# EAGLE design SD SPI SH Adaptor (EAGLE 9.6.2)
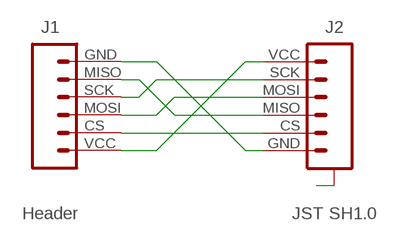
[diagram p0: schematic, sheet 1]

## Parts
J1  Header  HEADER-1X6-SD-SPI  [CONN_06-SD-SPI]
J2  JST SH1.0  JST-SH1.0-6-SMD-HORIZONTAL-SPI  [JST-SH1.0-6-HORIZONTAL-SPI]

## Nets
A: J2.A@1(A) J2.A@6(A)
N$1: J1.GND J2.GND
N$2: J1.VCC J2.VCC
N$3: J1.MISO J2.MISO
N$4: J1.MOSI J2.MOSI
N$5: J1.SCK J2.SCK
N$6: J1.CS J2.CS

## Library data of the parts
J1 = digitalconcepts:HEADER-1X6-SD-SPI: Single Row 6-Pin Header for SD Card Reader SPI Interface
J2 = digitalconcepts:JST-SH1.0-6-SMD-HORIZONTAL-SPI: JST SH1.0 6P SMD SPI horizontal connector

## Board
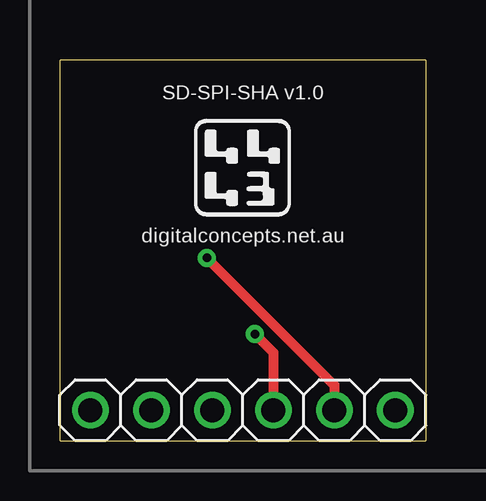
[diagram p1: board, top side]
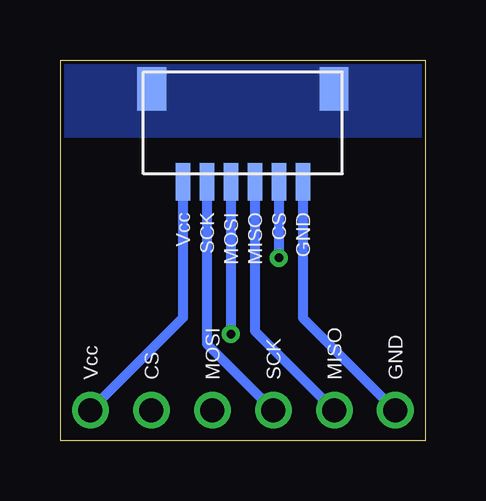
[diagram p2: board, bottom side, seen from below]

Size 15.24 x 15.88 mm. Coordinates in mm from the lower left corner, seen from the top.
Outline: 0,0 15.24,0 15.24,15.88 0,15.88 0,0
Copper layers (1*16): Top 0.035mm / dielectric 1.5mm / Bottom 0.035mm
Design rules "default *": minimum track width 6mil, minimum drill 0.35mm, track to track 6mil, track to pad 6mil, pad to pad 6mil, via to via 6mil, smd to smd 6mil, copper to edge 6mil, drill to drill 6mil, minimum pad ring 10mil, minimum via ring 8mil, stop-mask expansion 4mil, vias tented up to drill 0mil, thermal gap 10mil

### Footprints (pad centres in the part's own frame; a part is rotated, then mirrored left to right if it is on the bottom)
CONN_06-SD-SPI = drill 1 pad 1.524: CS 2.54,0; GND 12.7,0; MISO 10.16,0; MOSI 5.08,0; SCK 7.62,0; VCC 0,0
JST-SH1.0-6-HORIZONTAL-SPI = smd 1.2 x 1.8: A@1 -3.8,-1.335; A@6 3.8,-1.335 | smd 0.6 x 1.55: CS -1.5,2.54; GND -2.5,2.54; MISO -0.5,2.54; MOSI 0.5,2.54; SCK 1.5,2.54; VCC 2.5,2.54

### Placement (x,y rotation side)
J1  13.97,1.27 180 top
J2  7.62,13.34 180 bottom

### Tracks (layer width: path | path; a pad name or v marks a point on that pad's centre or on a via)
A
  pour Bottom (no thermals): 15.24,15.88 15.24,12.7 0,12.7 0,15.88
N$1
  Bottom 0.406: J2.GND 5.12,7.03 5.12,5.12 J1.GND
N$2
  Bottom 0.406: J2.VCC 10.12,5.12 J1.VCC
N$3
  Bottom 0.406: J1.MISO 7.12,4.58 J2.MISO
N$4  (via drill 0.35)
  Top 0.406: v8.12,4.45 8.89,3.68 J1.MOSI
  Bottom 0.406: J2.MOSI v8.12,4.45
N$5
  Bottom 0.406: J2.SCK 9.12,4.04 J1.SCK
N$6  (via drill 0.35)
  Top 0.406: v6.12,7.62 11.43,2.31 J1.CS
  Bottom 0.406: J2.CS v6.12,7.62

### Text on the board
tPlace: SD-SPI-SHA v1.0 | digitalconcepts.net.au
bNames: GND | CS | MISO | MOSI | SCK | Vcc | GND | MISO | SCK | MOSI | CS | Vcc